# EAGLE design untitled (EAGLE 7.2.0)
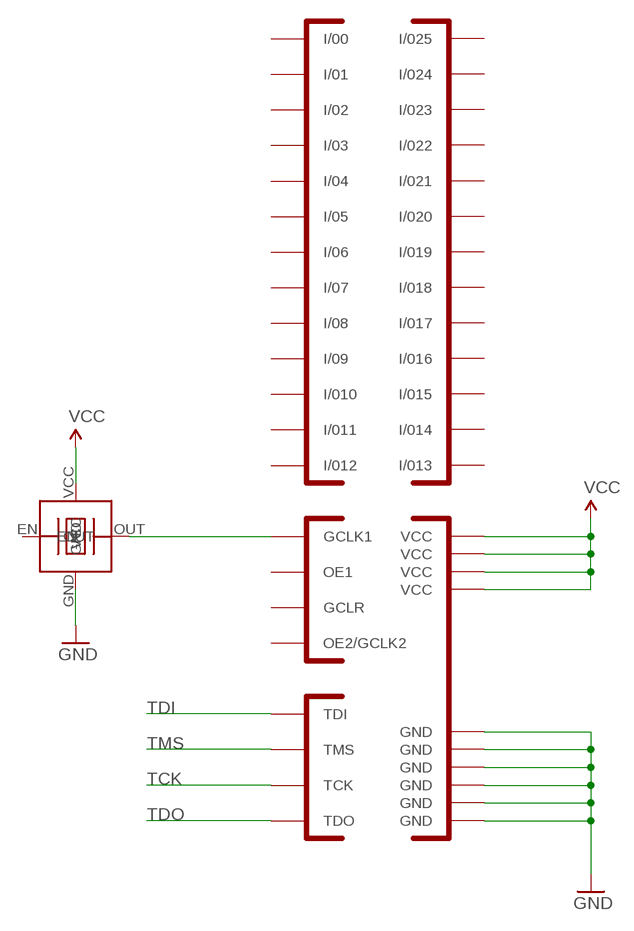
[diagram p0: schematic, sheet 1]

## Parts
U$1  EPM3032  [TQFP44]
U$2  TXC-BA  [7X5]

## Nets
GND: U$1.4(GND) U$1.11(GND) U$1.16(GND) U$1.24(GND) U$1.30(GND) U$1.36(GND) U$2.GND
N$1: U$1.37(GCLK1) U$2.OUT
TCK: U$1.26(TCK)
TDI: U$1.1(TDI)
TDO: U$1.32(TDO)
TMS: U$1.7(TMS)
VCC: U$1.9(VCC) U$1.17(VCC) U$1.29(VCC) U$1.41(VCC) U$2.VCC
Unconnected: U$2.EN

## Power pins joined to a net without a drawn wire
GCLR: U$1.39(GCLR)
I/00: U$1.2(I/00)
I/01: U$1.5(I/01)
I/02: U$1.6(I/02)
I/03: U$1.12(I/03)
I/04: U$1.13(I/04)
I/05: U$1.14(I/05)
I/06: U$1.15(I/06)
I/07: U$1.25(I/07)
I/08: U$1.44(I/08)
I/09: U$1.43(I/09)
I/010: U$1.42(I/010)
I/011: U$1.35(I/011)
I/012: U$1.34(I/012)
I/013: U$1.28(I/013)
I/014: U$1.27(I/014)
I/015: U$1.33(I/015)
I/016: U$1.21(I/016)
I/017: U$1.22(I/017)
I/018: U$1.23(I/018)
I/019: U$1.31(I/019)
I/020: U$1.18(I/020)
I/021: U$1.19(I/021)
I/022: U$1.8(I/022)
I/023: U$1.20(I/023)
I/024: U$1.10(I/024)
I/025: U$1.3(I/025)
OE1: U$1.38(OE1)
OE2/GCLK2: U$1.40(OE2/GCLK2)

## Library data of the parts
U$1 = EPM3032:EPM3032
U$2 = txc:TXC-BA**

## Board
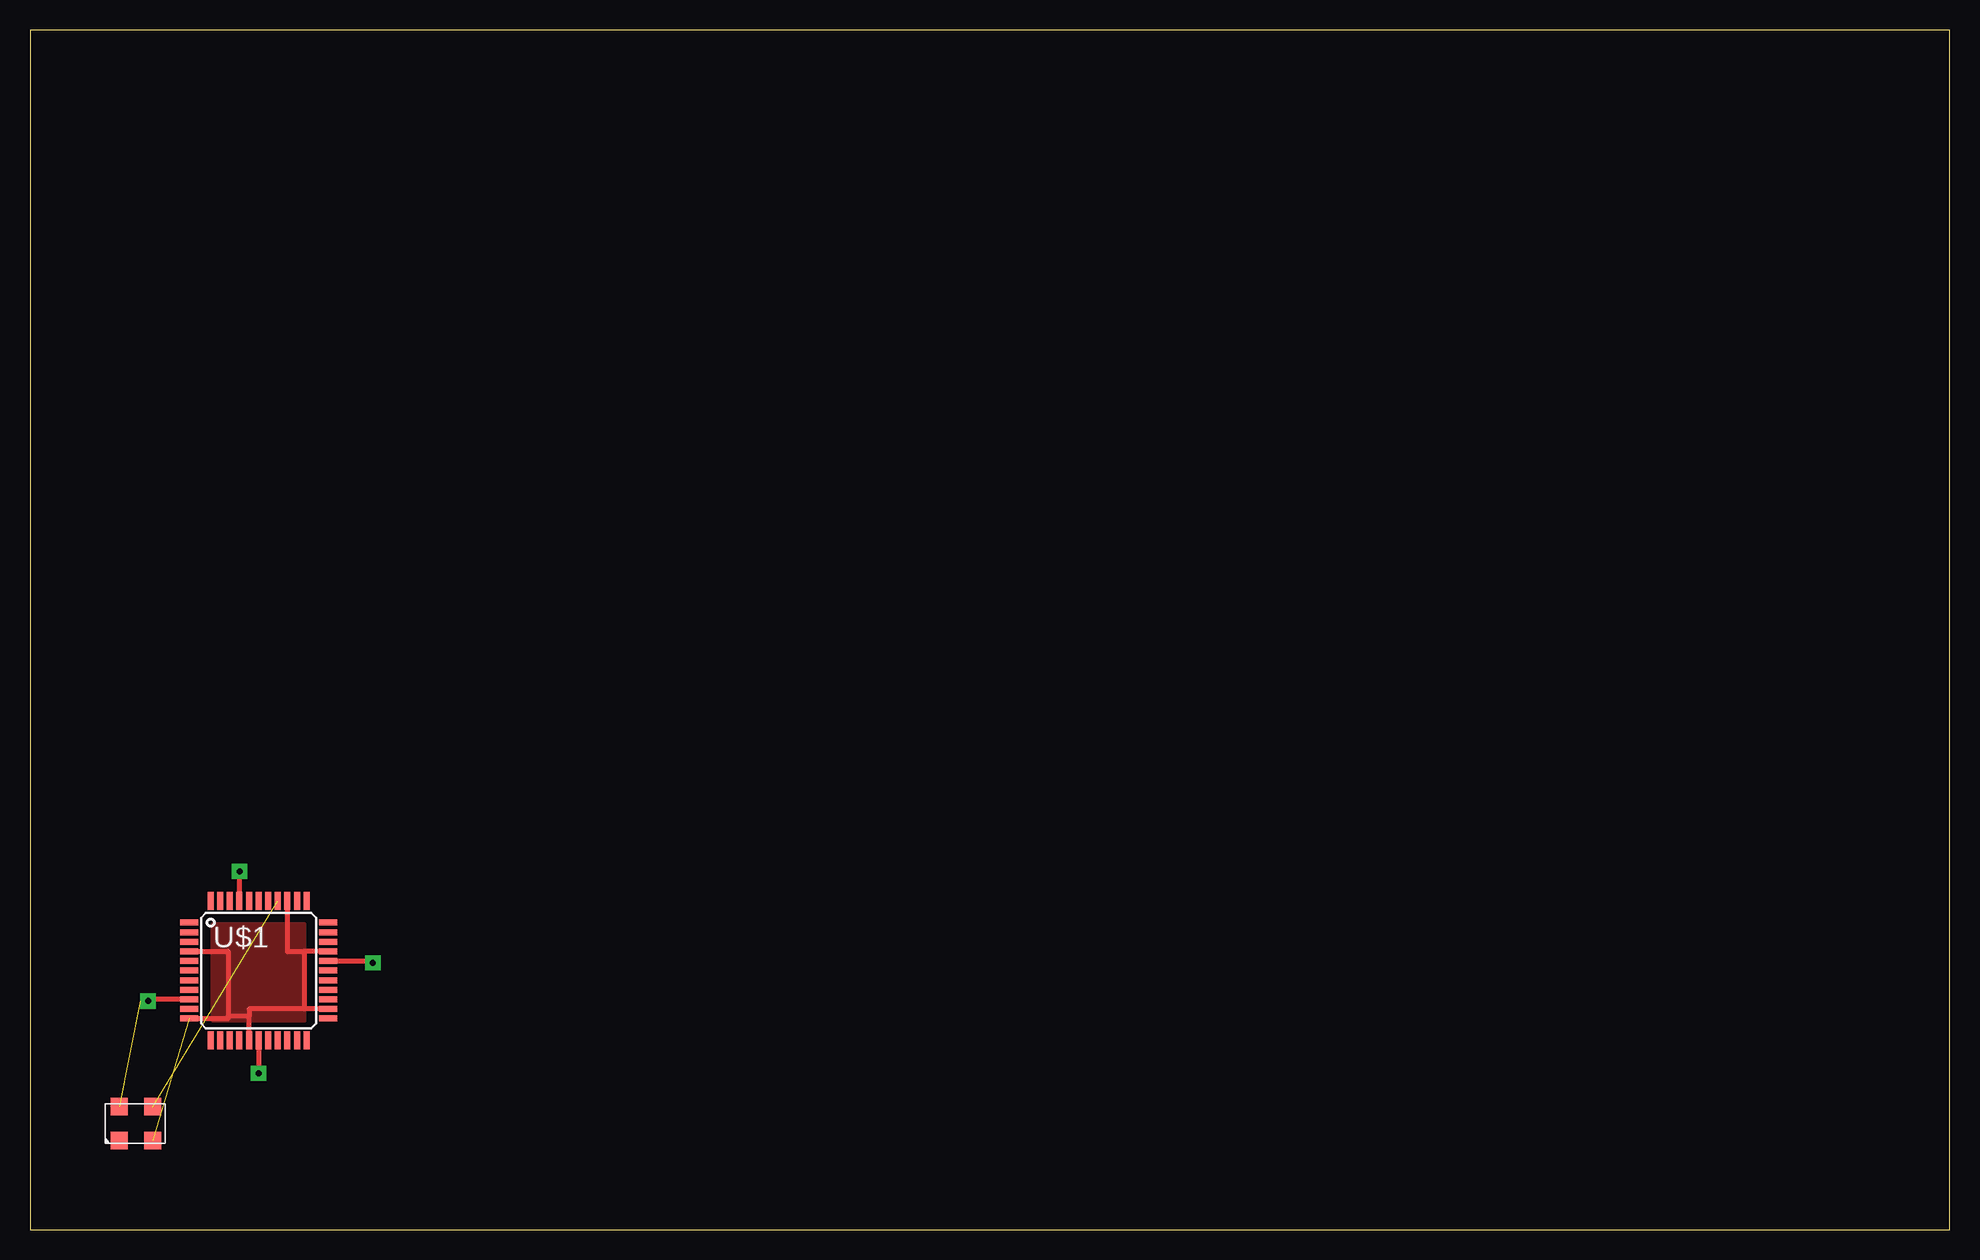
[diagram p1: board, top side]
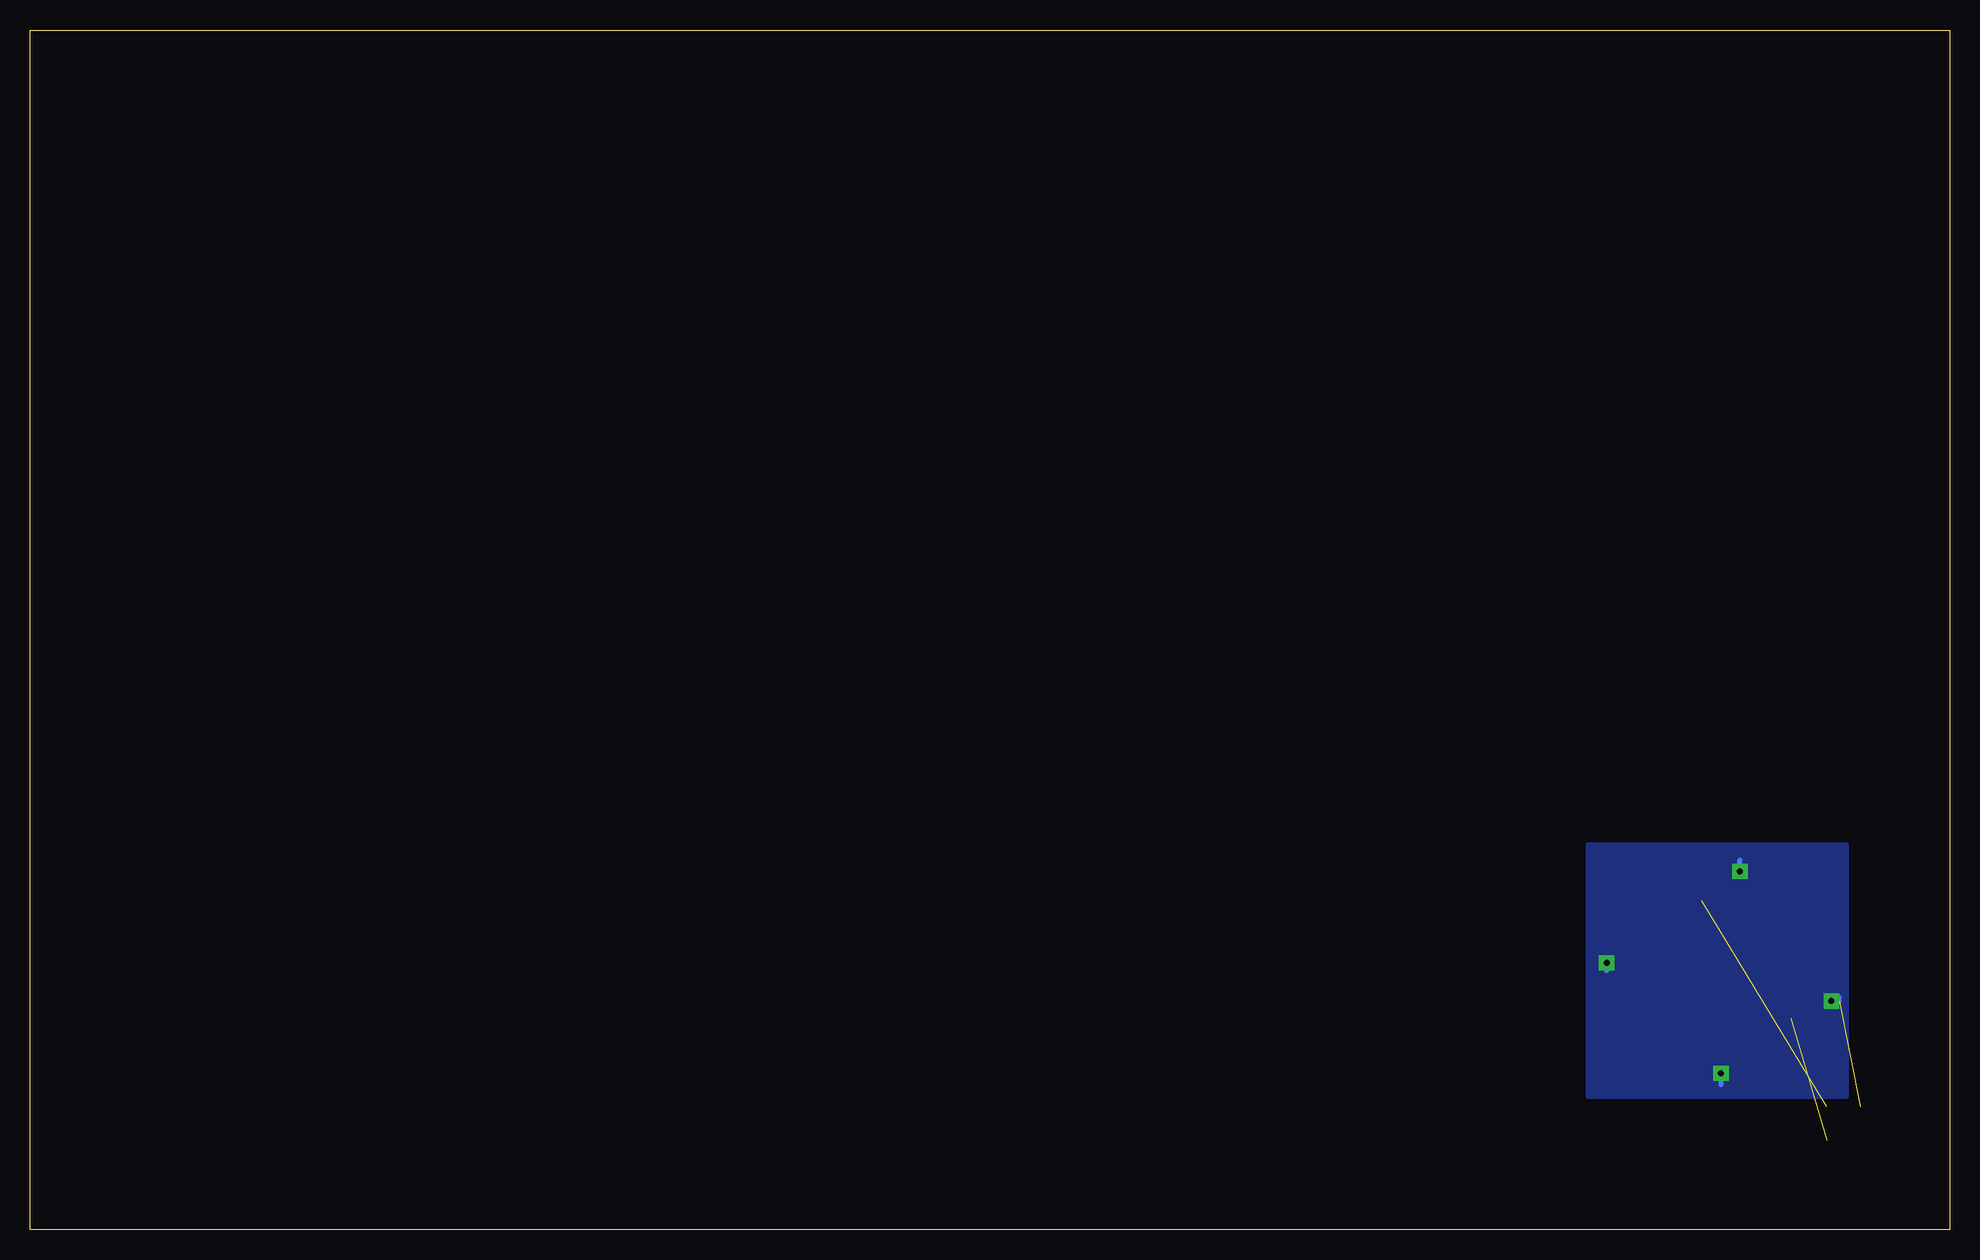
[diagram p2: board, bottom side, seen from below]

Size 160 x 100 mm. Coordinates in mm from the lower left corner, seen from the top.
Outline: 0,0 160,0 160,100 0,100 0,0
Copper layers (1*16): Top 0.035mm / dielectric 1.5mm / Bottom 0.035mm
Design rules "default": minimum track width 0.2mm, minimum drill 0.2mm, track to track 0.2mm, track to pad 0.2mm, pad to pad 0.2mm, via to via 0.2mm, smd to smd 0.2mm, copper to edge 0.2mm, drill to drill 0.2mm, minimum pad ring 10mil, minimum via ring 8mil, stop-mask expansion 4mil, vias tented up to drill 0mil, thermal gap 10mil

### Footprints (pad centres in the part's own frame; a part is rotated, then mirrored left to right if it is on the bottom)
TQFP44 = smd 1.5 x 0.5: 1 -5.8,4; 2 -5.8,3.2; 3 -5.8,2.4; 4 -5.8,1.6; 5 -5.8,0.8; 6 -5.8,0; 7 -5.8,-0.8; 8 -5.8,-1.6; 9 -5.8,-2.4; 10 -5.8,-3.2; 11 -5.8,-4; 23 5.8,-4; 24 5.8,-3.2; 25 5.8,-2.4; 26 5.8,-1.6; 27 5.8,-0.8; 28 5.8,0; 29 5.8,0.8; 30 5.8,1.6; 31 5.8,2.4; 32 5.8,3.2; 33 5.8,4 | smd 0.5 x 1.5: 12 -4,-5.8; 13 -3.2,-5.8; 14 -2.4,-5.8; 15 -1.6,-5.8; 16 -0.8,-5.8; 17 0,-5.8; 18 0.8,-5.8; 19 1.6,-5.8; 20 2.4,-5.8; 21 3.2,-5.8; 22 4,-5.8; 34 4,5.8; 35 3.2,5.8; 36 2.4,5.8; 37 1.6,5.8; 38 0.8,5.8; 39 0,5.8; 40 -0.8,5.8; 41 -1.6,5.8; 42 -2.4,5.8; 43 -3.2,5.8; 44 -4,5.8
7X5 = smd 1.4 x 1.45: EN -1.448,-1.465; GND 1.333,-1.465; OUT 1.333,1.345; VCC -1.448,1.345

### Placement (x,y rotation side)
U$1  19.05,21.59 0 top
U$2  TXC-BA*  [7X5]  8.89,8.89 0 top

### Tracks (layer width: path | path; a pad name or v marks a point on that pad's centre or on a via)
GND  (1 unrouted)
  Top 0.406: U$1.4 16.51,23.19 16.51,17.78 | 16.51,17.78 16.51,17.59 U$1.11 | U$1.16 18.25,17.78 | 18.25,17.78 16.51,17.78 | U$1.24 22.86,18.39 | 22.86,18.39 18.25,18.39 18.25,17.78 | U$1.30 22.86,23.19 22.86,23.18 | 22.86,23.18 22.86,18.39 | U$1.36 21.45,23.18 22.86,23.18
  pour Top: 15.24,25.4 15.24,17.46 22.86,17.46 22.86,25.4
N$1  (1 unrouted)
VCC  (via drill 0.5 pad 1.27)  (1 unrouted)
  Top 0.406: U$1.41 17.46,27.39 v17.46,29.84 | U$1.29 28.57,22.39 v28.57,22.23 | U$1.17 v19.05,13.02 | U$1.9 9.84,19.19 v9.84,19.05
  Bottom 0.406: v17.46,29.84 17.46,30.8 | v28.57,22.23 28.57,21.59 | v19.05,13.02 19.05,12.06 | v9.84,19.05 9.21,19.05 9.21,19.37
  pour Bottom: 8.57,32.07 30.16,32.07 30.16,11.11 8.57,11.11